# EAGLE design 16_step_schematic_switch_debouncer (EAGLE 5.07)
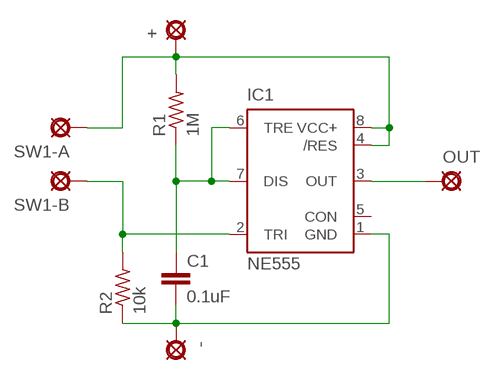
[diagram p0: schematic, sheet 1]

## Parts
+  PAD  [SQUARE]
-  PAD8  [OCTOGON]
C1  0.1uF  050X030_0251  [050X030_025]
IC1  NE555  [DIL-08]
OUT  PAD  [SQUARE]
R1  1M  6MM.4  [R0207/4]
R2  10k  6MM.4  [R0207/4]
SW1-A  PAD  [SQUARE]
SW1-B  PAD  [SQUARE]

## Nets
N$1: C1.1 IC1.6(TRE) IC1.7(DIS) R1.1
N$2: IC1.3(OUT) OUT.1(PAD)
N$3: +.1(PAD) IC1.4(/RES) IC1.8(VCC+) R1.2 SW1-A.1(PAD)
N$4: IC1.2(TRI) R2.2 SW1-B.1(PAD)
N$7: -.1(PAD) C1.2 IC1.1(GND) R2.1
Unconnected: IC1.5(CON)

## Library data of the parts
+ - OUT SW1-A SW1-B = gm-supply:PAD: PAD use this package for pads with any purpose, including input, output, send or return various pad shapes: round, square, octogonal, long, and long offset
C1 = gm-caps-ceramic:050X030_025: 47 - 120pF Xicon Ceramic Disc 2.5mm lead spacing
IC1 = st-microelectronics:NE555: General purpose bipolar Timer
R1 R2 = gm-resistors:6MM: 6mm Resistors Leads spaced 1-6 holes apart for 0.1" perfboard. Suitable for 1/4 watt resistors.

## Board
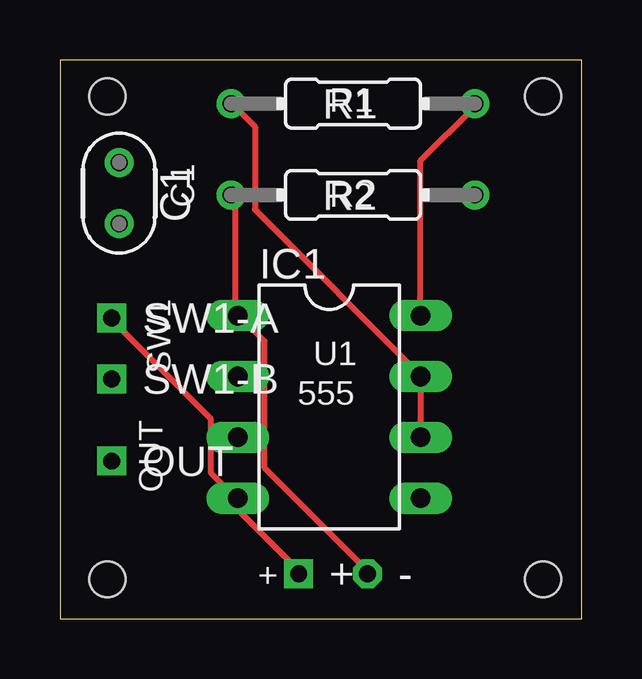
[diagram p1: board, top side]
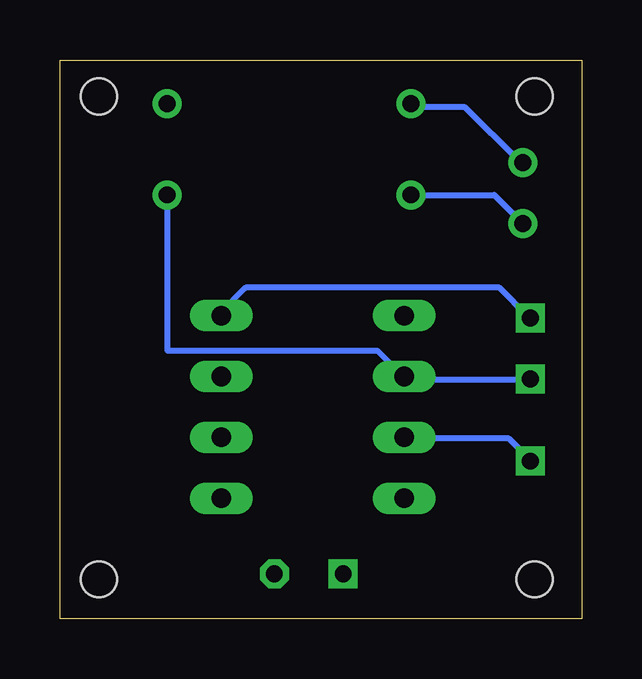
[diagram p2: board, bottom side, seen from below]

Size 21.77 x 23.31 mm. Coordinates in mm from the lower left corner, seen from the top.
Outline: 0,0 21.77,0 21.77,23.31 0,23.31 0,0
Copper layers (1*16): Top 0.035mm / dielectric 1.5mm / Bottom 0.035mm
Design rules "default *": minimum track width 10mil, minimum drill 24mil, track to track 8mil, track to pad 8mil, pad to pad 8mil, via to via 8mil, smd to smd 8mil, copper to edge 40mil, drill to drill 8mil, minimum pad ring 10mil, minimum via ring 8mil, stop-mask expansion 4mil, vias tented up to drill 0mil, thermal gap 10mil
Holes 1.5 mm at 1.98,21.79 20.14,21.79 20.14,1.65 1.98,1.65

### Footprints (pad centres in the part's own frame; a part is rotated, then mirrored left to right if it is on the bottom)
SQUARE = drill 0.7 square: 1 0,0
OCTOGON = drill 0.7 octagon: 1 0,0
050X030_025 = drill 0.7 round: 1 -1.27,0; 2 1.27,0
DIL-08 = drill 0.813 long: 1 -3.81,-3.81; 2 -1.27,-3.81; 3 1.27,-3.81; 4 3.81,-3.81; 5 3.81,3.81; 6 1.27,3.81; 7 -1.27,3.81; 8 -3.81,3.81
R0207/4 = drill 0.7 round: 1 -5.08,0; 2 5.08,0

### Placement (x,y rotation side)
+  9.96,1.88 0 top
-  12.83,1.88 0 top
C1  2.46,17.75 270 top
IC1  11.23,8.84 270 top
OUT  2.16,6.58 0 top
R1  12.22,21.49 0 top
R2  12.22,17.68 0 top
SW1-A  2.16,12.55 0 top
SW1-B  2.16,10.01 0 top

### Tracks (layer width: path | path; a pad name or v marks a point on that pad's centre or on a via)
N$1
  Top 0.254: IC1.6 IC1.7 15.04,10.16 8.13,17.07 8.13,20.52 7.32,21.34 R1.1
  Bottom 0.254: C1.1 2.64,19.1 4.88,21.34 7.11,21.34 R1.1
N$2
  Bottom 0.254: OUT.1 2.23,6.71 3.05,7.52 7.32,7.52 IC1.3
N$3
  Top 0.254: R1.2 17.27,21.34 15.04,19.1 IC1.8 | SW1-A.1 2.23,12.39 6.3,8.33 6.3,6.1 7.32,5.08 IC1.4 7.52,4.88 7.52,4.47 9.96,2.03 +.1
  Bottom 0.254: IC1.8 15.04,12.8 14.02,13.82 3.45,13.82 2.23,12.6 SW1-A.1
N$4
  Bottom 0.254: SW1-B.1 2.23,9.96 7.32,9.96 IC1.2 7.52,10.16 8.53,11.18 17.27,11.18 17.27,17.68 R2.2
N$7
  Top 0.254: -.1 12.8,2.03 8.53,6.3 8.53,11.58 7.52,12.6 IC1.1 7.32,12.8 7.32,17.68 R2.1
  Bottom 0.254: C1.2 3.66,17.68 R2.1

### Text on the board
tPlace: R1 | C1 | R2 | U1 | SW1 | 555 | OUT | + | -